# Altium project RFC_MB.PrjPcb (part 4 of 7)

## Sheet Hall.SchDoc
size 594 x 420 mm; Address1: Address1; Address2: Address2; Address3: Address3; Address4: Address4; SheetNumber: 1; Scale: 1:1; Разраб.: Иванов; Обозначение документа: АБВГ.123456.001 Э3; Пров.: Петров; Утв.: Сидоров; Наименование организации: ОАО "Концерн "МПО-Гидроприбор"; Перв. применение: АБВГ.123456.000; Наименование изделия 1: Плата; Наименование изделия 2: Схема электрическая; Наименование изделия 3: принципиальная; Нач. отд.: Нач. отд.; Фамилия нач. отд.: Сидоров
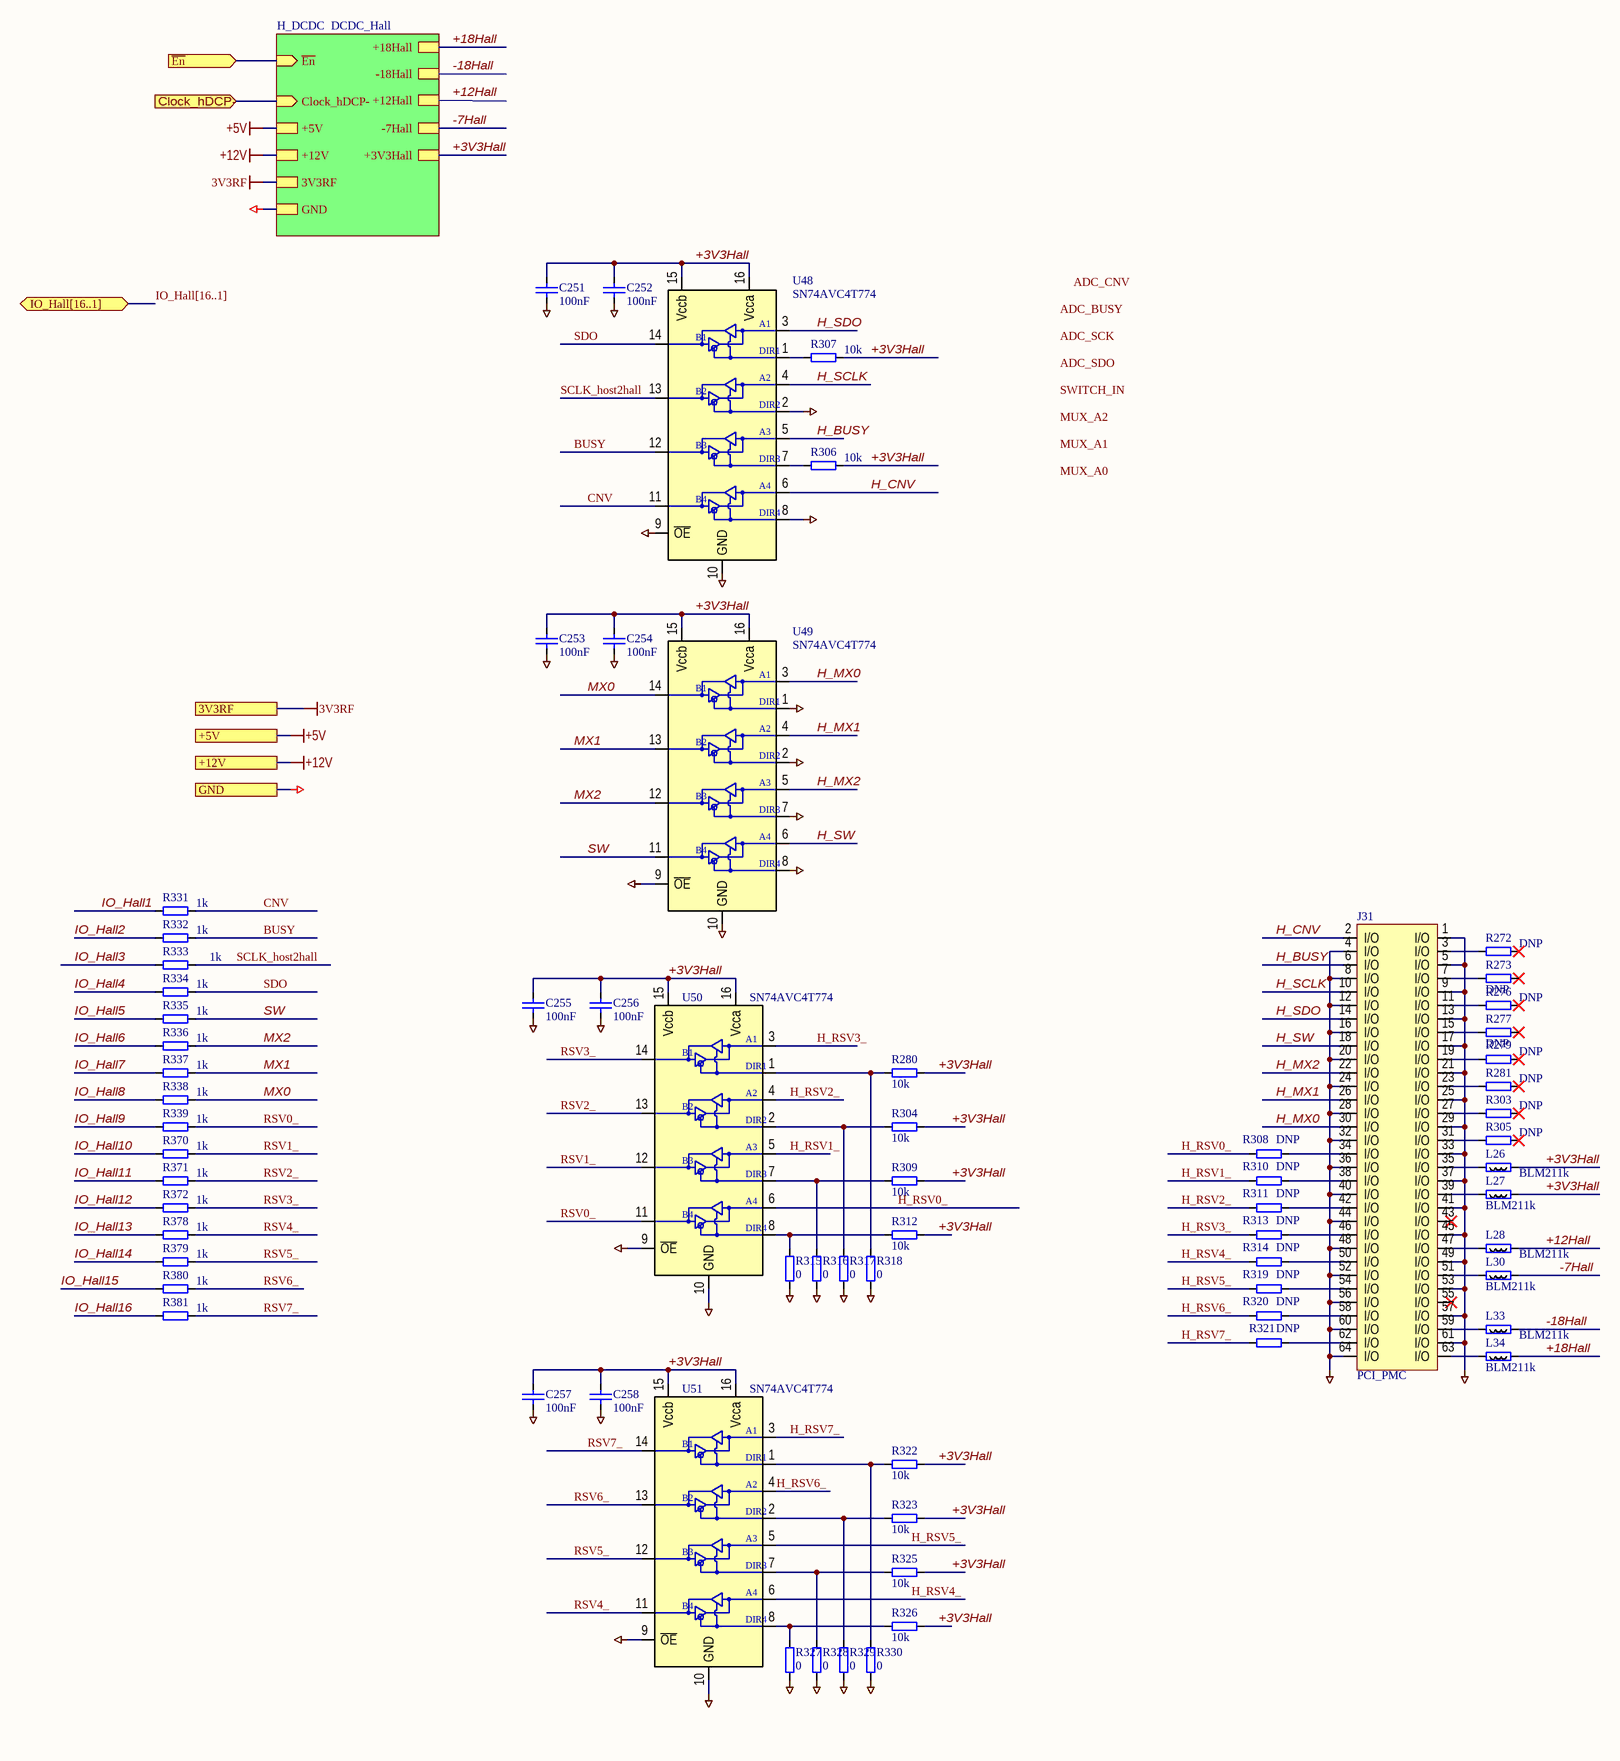
[diagram p13: Hall.SchDoc]

### Parts
C251  100nF  [SMD0805CAP]
C252  100nF  [SMD0805CAP]
C253  100nF  [SMD0805CAP]
C254  100nF  [SMD0805CAP]
C255  100nF  [SMD0805CAP]
C256  100nF  [SMD0805CAP]
C257  100nF  [SMD0805CAP]
C258  100nF  [SMD0805CAP]
J31  PCI_PMC  [TYCO_120521-1]
L26  BLM211k  [RESC2012X50N]
L27  BLM211k  [RESC2012X50N]
L28  BLM211k  [RESC2012X50N]
L30  BLM211k  [RESC2012X50N]
L33  BLM211k  [RESC2012X50N]
L34  BLM211k  [RESC2012X50N]
R272  DNP  [SMD0805RES]
R273  DNP  [SMD0805RES]
R276  DNP  [SMD0805RES]
R277  DNP  [SMD0805RES]
R279  DNP  [SMD0805RES]
R280  10k  [SMD0805RES]
R281  DNP  [SMD0805RES]
R303  DNP  [SMD0805RES]
R304  10k  [SMD0805RES]
R305  DNP  [SMD0805RES]
R306  10k  [SMD0805RES]
R307  10k  [SMD0805RES]
R308  DNP  [SMD0805RES]
R309  10k  [SMD0805RES]
R310  DNP  [SMD0805RES]
R311  DNP  [SMD0805RES]
R312  10k  [SMD0805RES]
R313  DNP  [SMD0805RES]
R314  DNP  [SMD0805RES]
R315  0  [SMD0805RES]
R316  0  [SMD0805RES]
R317  0  [SMD0805RES]
R318  0  [SMD0805RES]
R319  DNP  [SMD0805RES]
R320  DNP  [SMD0805RES]
R321  DNP  [SMD0805RES]
R322  10k  [SMD0805RES]
R323  10k  [SMD0805RES]
R325  10k  [SMD0805RES]
R326  10k  [SMD0805RES]
R327  0  [SMD0805RES]
R328  0  [SMD0805RES]
R329  0  [SMD0805RES]
R330  0  [SMD0805RES]
R331  1k  [SMD0805RES]
R332  1k  [SMD0805RES]
R333  1k  [SMD0805RES]
R334  1k  [SMD0805RES]
R335  1k  [SMD0805RES]
R336  1k  [SMD0805RES]
R337  1k  [SMD0805RES]
R338  1k  [SMD0805RES]
R339  1k  [SMD0805RES]
R370  1k  [SMD0805RES]
R371  1k  [SMD0805RES]
R372  1k  [SMD0805RES]
R378  1k  [SMD0805RES]
R379  1k  [SMD0805RES]
R380  1k  [SMD0805RES]
R381  1k  [SMD0805RES]
U48  SN74AVC4T774  [TSSOP-16]
U49  SN74AVC4T774  [TSSOP-16]
U50  SN74AVC4T774  [TSSOP-16]
U51  SN74AVC4T774  [TSSOP-16]

### Sub-sheets
H_DCDC = DCDC_Hall: +18Hall, -18Hall, +12Hall, -7Hall, +3V3Hall, ~{En} (in), Clock_hDCP- (in), GND, +12V, +5V, 3V3RF

### Ports
3V3RF, +5V, +12V, Clock_hDCP- (in), GND, IO_Hall[16..1] (bidir), ~{En} (in)

### Nets
3V3RF: port 3V3RF, sheet H_DCDC/3V3RF
+5V: port +5V, sheet H_DCDC/+5V
+12V: port +12V, sheet H_DCDC/+12V
GND: C251.1 C252.1 C253.1 C254.1 C255.1 C256.1 C257.1 C258.1 J31.1(I/O) J31.4(I/O) J31.5(I/O) J31.8(I/O) J31.9(I/O) J31.12(I/O) J31.13(I/O) J31.16(I/O) J31.17(I/O) J31.20(I/O) J31.21(I/O) J31.24(I/O) J31.25(I/O) J31.28(I/O) J31.29(I/O) J31.32(I/O) J31.33(I/O) J31.36(I/O) J31.37(I/O) J31.40(I/O) J31.41(I/O) J31.44(I/O) J31.45(I/O) J31.48(I/O) J31.49(I/O) J31.52(I/O) J31.53(I/O) J31.56(I/O) J31.57(I/O) J31.60(I/O) J31.61(I/O) J31.64(I/O) R315.1 R316.1 R317.1 R318.1 R327.1 R328.1 R329.1 R330.1 U48.2(DIR2) U48.8(DIR4) U48.9(~{OE}) U48.10(GND) U49.1(DIR1) U49.2(DIR2) U49.7(DIR3) U49.8(DIR4) U49.9(~{OE}) U49.10(GND) U50.9(~{OE}) U50.10(GND) U51.9(~{OE}) U51.10(GND) ; port GND, sheet H_DCDC/GND
+3V3Hall: C251.2 C252.2 C253.2 C254.2 C255.2 C256.2 C257.2 C258.2 L26.2 L27.2 R280.2 R304.2 R306.1 R307.1 R309.2 R312.2 R322.2 R323.2 R325.2 R326.2 U48.15(Vccb) U48.16(Vcca) U49.15(Vccb) U49.16(Vcca) U50.15(Vccb) U50.16(Vcca) U51.15(Vccb) U51.16(Vcca) ; sheet H_DCDC/+3V3Hall
+12Hall: L28.2 ; sheet H_DCDC/+12Hall
+18Hall: L34.2 ; sheet H_DCDC/+18Hall
-7Hall: L30.2 ; sheet H_DCDC/-7Hall
-18Hall: L33.2 ; sheet H_DCDC/-18Hall
~{En}: port ~{En}, sheet H_DCDC/~{En}
BUSY: R332.1 U48.12(B3)
Clock_hDCP-: port Clock_hDCP-, sheet H_DCDC/Clock_hDCP-
CNV: R331.1 U48.11(B4)
H_BUSY: J31.6(I/O) U48.5(A3)
H_CNV: J31.2(I/O) U48.6(A4)
H_MX0: J31.30(I/O) U49.3(A1)
H_MX1: J31.26(I/O) U49.4(A2)
H_MX2: J31.22(I/O) U49.5(A3)
H_RSV0_: R308.2 U50.6(A4)
H_RSV1_: R310.2 U50.5(A3)
H_RSV2_: R311.2 U50.4(A2)
H_RSV3_: R313.2 U50.3(A1)
H_RSV4_: R314.2 U51.6(A4)
H_RSV5_: R319.2 U51.5(A3)
H_RSV6_: R320.2 U51.4(A2)
H_RSV7_: R321.2 U51.3(A1)
H_SCLK: J31.10(I/O) U48.4(A2)
H_SDO: J31.14(I/O) U48.3(A1)
H_SW: J31.18(I/O) U49.6(A4)
IO_Hall1: R331.2  [project net IO_BL1]
IO_Hall2: R332.2  [project net IO_BL2]
IO_Hall3: R333.2  [project net IO_BL3]
IO_Hall4: R334.2  [project net IO_BL4]
IO_Hall5: R335.2  [project net IO_BL5]
IO_Hall6: R336.2  [project net IO_BL6]
IO_Hall7: R337.2  [project net IO_BL7]
IO_Hall8: R338.2  [project net IO_BL8]
IO_Hall9: R339.2  [project net IO_BL9]
IO_Hall10: R370.2  [project net IO_BL10]
IO_Hall11: R371.2  [project net IO_BL11]
IO_Hall12: R372.2  [project net IO_BL12]
IO_Hall13: R378.2  [project net IO_BL13]
IO_Hall14: R379.2  [project net IO_BL14]
IO_Hall15: R380.2  [project net IO_BL15]
IO_Hall16: R381.2  [project net IO_BL16]
MX0: R338.1 U49.14(B1)
MX1: R337.1 U49.13(B2)
MX2: R336.1 U49.12(B3)
RSV0_: R339.1 U50.11(B4)
RSV1_: R370.1 U50.12(B3)
RSV2_: R371.1 U50.13(B2)
RSV3_: R372.1 U50.14(B1)
RSV4_: R378.1 U51.11(B4)
RSV5_: R379.1 U51.12(B3)
RSV6_: R380.1 U51.13(B2)
RSV7_: R381.1 U51.14(B1)
SCLK_host2hall: R333.1 U48.13(B2)
SDO: R334.1 U48.14(B1)
SW: R335.1 U49.11(B4)
NetJ31_3: J31.3(I/O) R272.2
NetJ31_7: J31.7(I/O) R273.1
NetJ31_11: J31.11(I/O) R276.2
NetJ31_15: J31.15(I/O) R277.1
NetJ31_19: J31.19(I/O) R279.2
NetJ31_23: J31.23(I/O) R281.2
NetJ31_27: J31.27(I/O) R303.2
NetJ31_31: J31.31(I/O) R305.2
NetJ31_34: J31.34(I/O) R308.1
NetJ31_35: J31.35(I/O) L26.1
NetJ31_38: J31.38(I/O) R310.1
NetJ31_39: J31.39(I/O) L27.1
NetJ31_42: J31.42(I/O) R311.1
NetJ31_46: J31.46(I/O) R313.1
NetJ31_47: J31.47(I/O) L28.1
NetJ31_50: J31.50(I/O) R314.1
NetJ31_51: J31.51(I/O) L30.1
NetJ31_54: J31.54(I/O) R319.1
NetJ31_58: J31.58(I/O) R320.1
NetJ31_59: J31.59(I/O) L33.1
NetJ31_62: J31.62(I/O) R321.1
NetJ31_63: J31.63(I/O) L34.1
NetR280_1: R280.1 R318.2 U50.1(DIR1)
NetR304_1: R304.1 R317.2 U50.2(DIR2)
NetR306_2: R306.2 U48.7(DIR3)
NetR307_2: R307.2 U48.1(DIR1)
NetR309_1: R309.1 R316.2 U50.7(DIR3)
NetR312_1: R312.1 R315.2 U50.8(DIR4)
NetR322_1: R322.1 R330.2 U51.1(DIR1)
NetR323_1: R323.1 R329.2 U51.2(DIR2)
NetR325_1: R325.1 R328.2 U51.7(DIR3)
NetR326_1: R326.1 R327.2 U51.8(DIR4)

Not connected (* = marked no-connect by the designer): J31 43(I/O)* 55(I/O)*; R272 1*; R273 2*; R276 1*; R277 2*; R279 1*; R281 1*; R303 1*; R305 1*

### Buses and harness runs
bus IO_Hall[16..1] = port IO_Hall[16..1]

### Notes on the sheet
- Labels drawn without touching a wire or pin: ADC_BUSY, ADC_CNV, ADC_SCK, ADC_SDO, MUX_A0, MUX_A1, MUX_A2, SWITCH_IN
- Подп. и дата
- Инв. № дубл.
- Взам. инв. №
- Инв. № подл.
- Изм.
- Лист
- № докум.
- Подп.
- Дата
- Копировал
- Формат А2

### Library data of the parts
C251-C258 = C0805: as C151 on sheet RFCtl; Value: 100nF; Price: 2
J31 = PCI_PMC_M: PCI Mezzanine Connector; IEEE 1386 MainBoard; Manufactuer: TE Connectivity; PartField: 120527-1; SolderOption: 2; Pkg: PMC Male (IEEE 1386); Value: PCI_PMC; Vendor: TE Connectivity
L26-L28 L30 L33 L34 = BLM21: SMD Ferrite bead 0805; Vendor: Vishay; Value: 1k; Pkg: SMD0805; SMD Solders: 2; Solder Option: RM; Price: 10; Device: BLM21
R272 R276 R279 R281 R303 R305-R308 R310 R311 R313 R314 R319-R321 R331 R332 R334-R339 R370-R372 R378-R381 = R0805: Чип резистор 0805; Vendor: Vishay; SMD Solders: 2; Solder Option: i; TC: 100ppm/C; Tolerance: 1%; Pkg: SMD0805; Pwr: 125mW; Device: Res0805; Price: 2
  R272 R276 R279 R281 R303 R305 R308 R310 R311 R313 R314 R319-R321: Value: DNP
  R306 R307: Value: 10k
  R331 R332 R334-R339 R370-R372 R378-R381: Value: 1k
R273 R277 R280 R304 R309 R312 R315-R318 R322 R323 R325-R330 R333 = R0805: as R177 on sheet RFCtl; Price: 2
  R273 R277: Value: DNP
  R280 R304 R309 R312 R322 R323 R325 R326: Value: 10k
  R315-R318 R327-R330: Value: 0
  R333: Value: 1k
U48-U51 = SN74AVC4T774: Двунаправленный буфер; Pkg: TSSOP16; SMD Solders: 16; Solder Option: RM; THD Solders: 0; Vendor: Texas Instruments; Voltage: 1V1.. 3.6V  I/Os are 4.6-V Tolerant; Name to order: SN74AVC4T774PW; Device: SN74AVC4T774; Price: 300

## Sheet DCDC_Hall.SchDoc
size 420 x 297 mm; Address1: Address1; Address2: Address2; Address3: Address3; Address4: Address4; SheetNumber: 1; Scale: 1:1; Разраб.: Иванов; Обозначение документа: АБВГ.123456.001 Э3; Пров.: Петров; Утв.: Сидоров; Наименование организации: ОАО "Концерн "МПО-Гидроприбор"; Перв. применение: АБВГ.123456.000; Наименование изделия 1: Плата; Наименование изделия 2: Схема электрическая; Наименование изделия 3: принципиальная; Нач. отд.: Нач. отд.; Фамилия нач. отд.: Сидоров
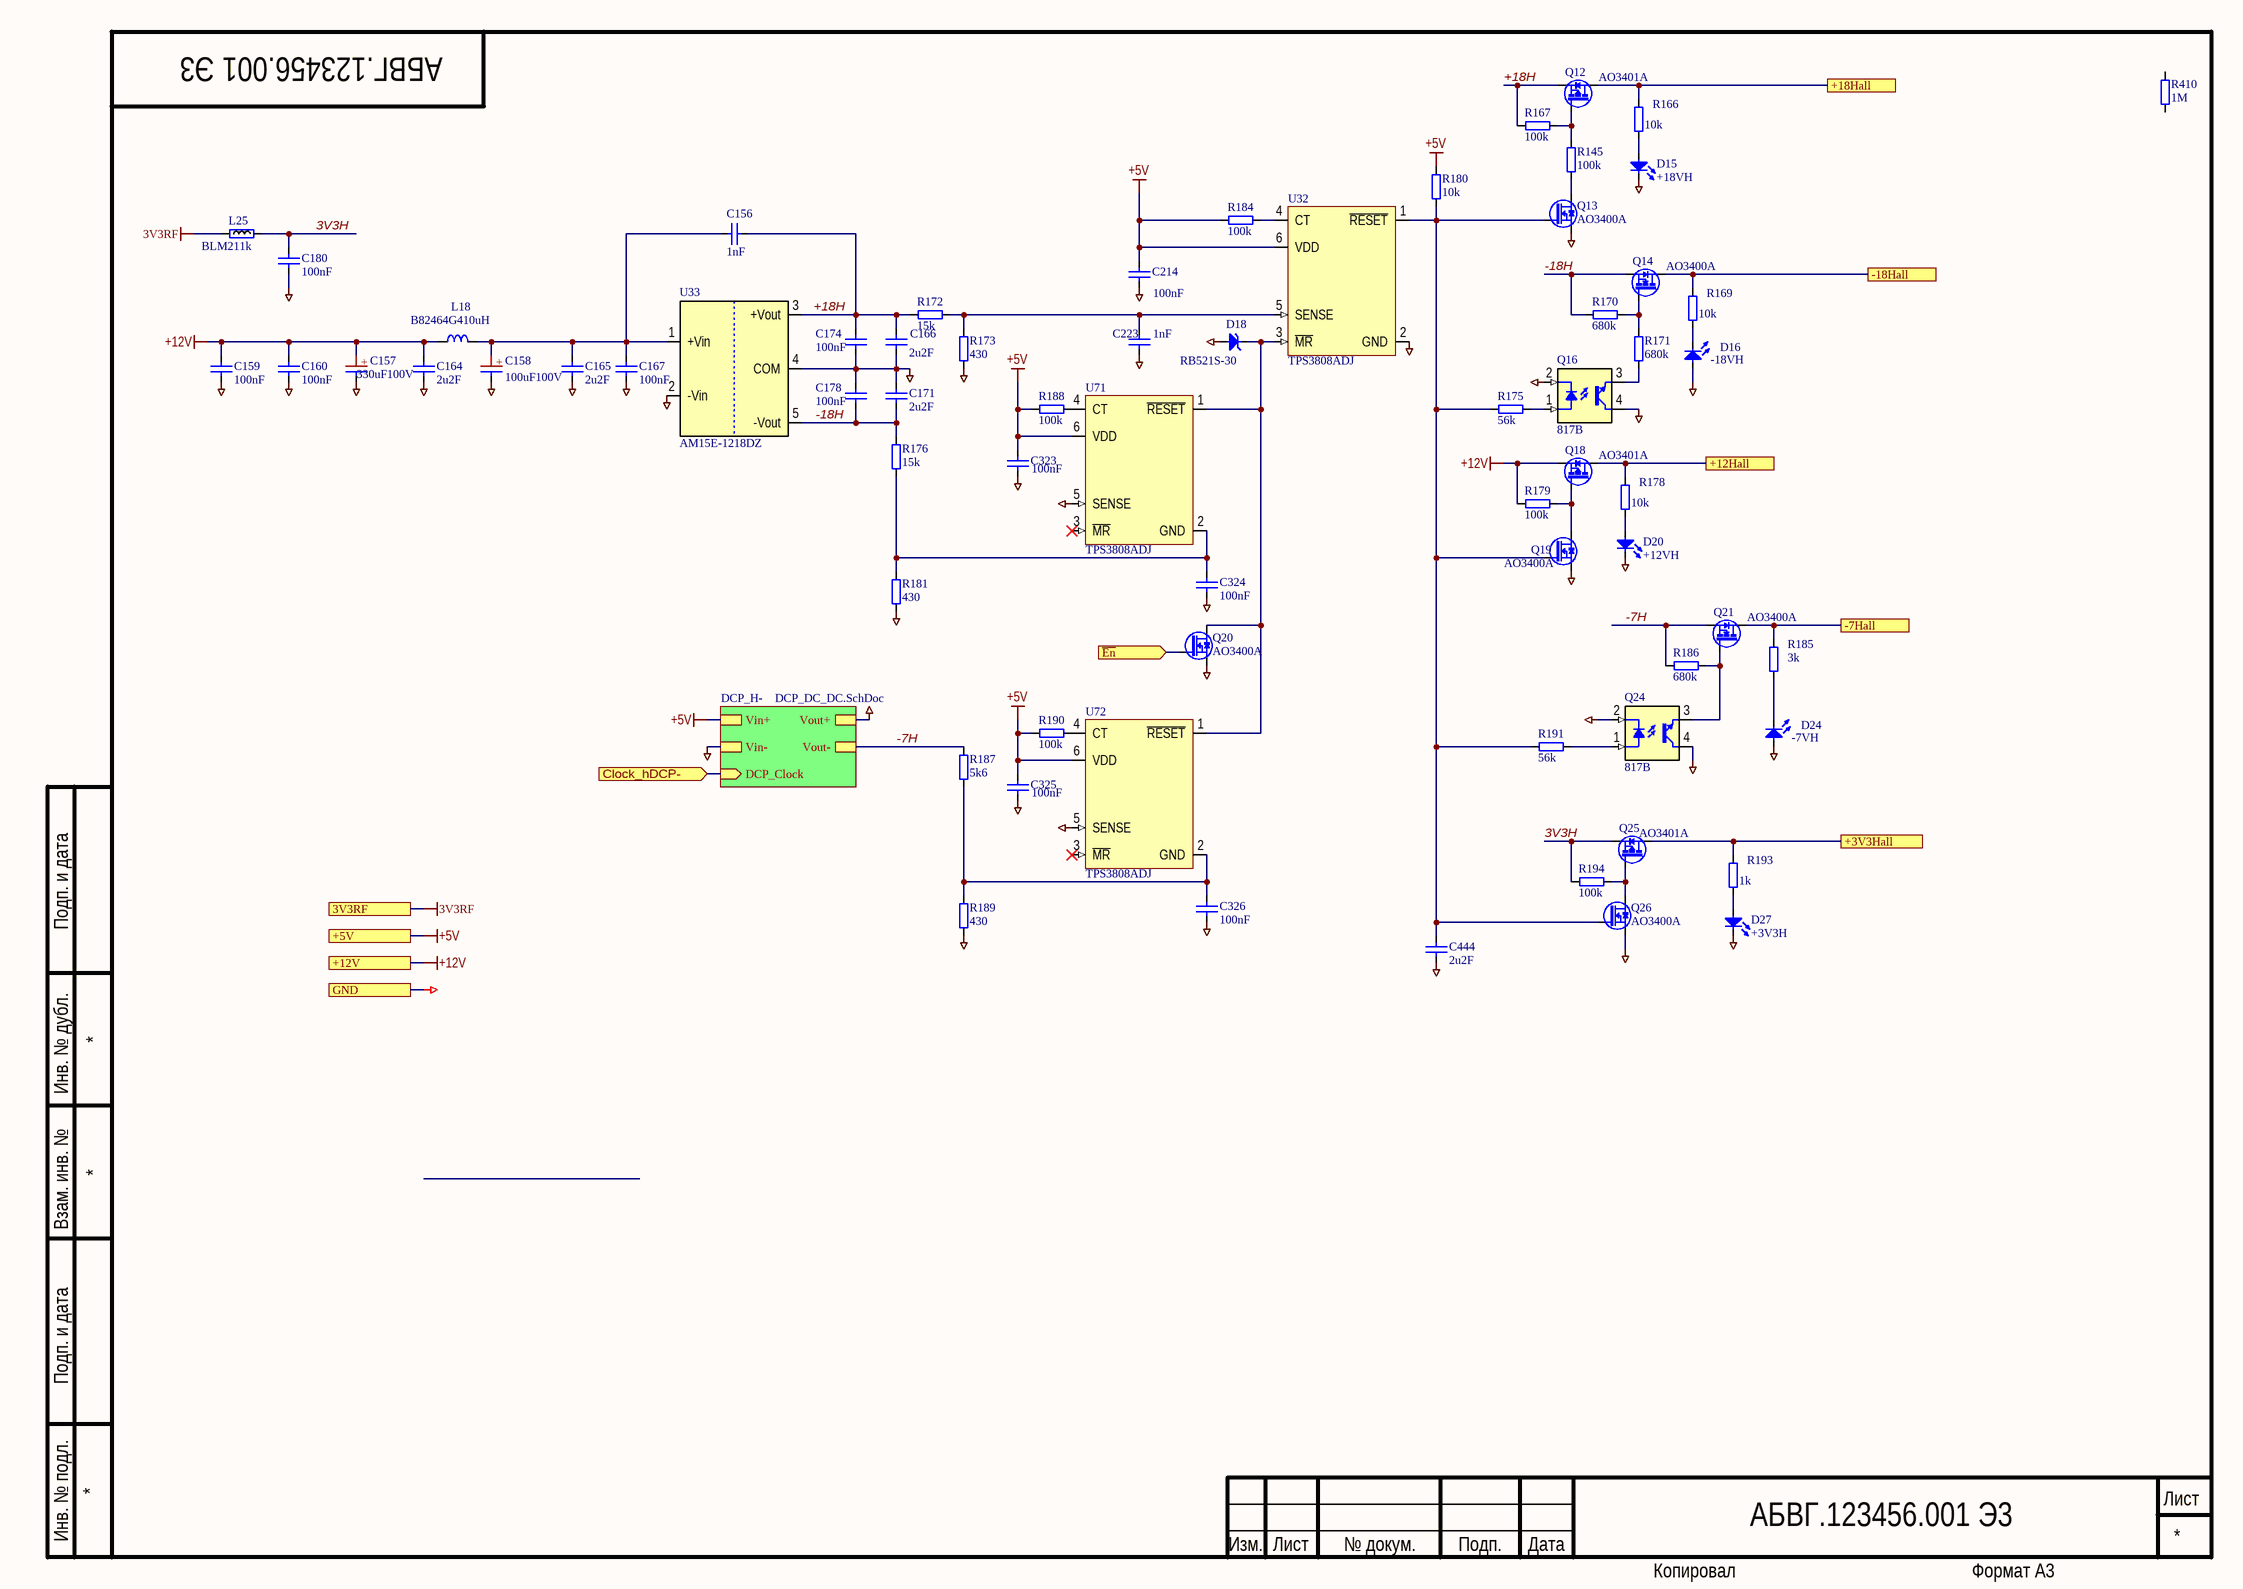
[diagram p14: DCDC_Hall.SchDoc]

### Parts
C156  1nF  [SMD0805CAP]
C157  330uF100V  [CAPPR750-1600X2000]
C158  100uF100V  [CAPPR500-1000X1250]
C159  100nF  [SMD0805CAP]
C160  100nF  [SMD0805CAP]
C164  2u2F  [SMD0805CAP]
C165  2u2F  [SMD0805CAP]
C166  2u2F  [SMD0805CAP]
C167  100nF  [SMD0805CAP]
C171  2u2F  [SMD0805CAP]
C174  100nF  [SMD0805CAP]
C178  100nF  [SMD0805CAP]
C180  100nF  [SMD0805CAP]
C214  100nF  [SMD0805CAP]
C223  1nF  [SMD0805CAP]
C323  100nF  [SMD0805CAP]
C324  100nF  [SMD0805CAP]
C325  100nF  [SMD0805CAP]
C326  100nF  [SMD0805CAP]
C444  2u2F  [SMD0805CAP]
D15  +18VH  [LED0603]
D16  -18VH  [LED0603]
D18  RB521S-30  [SODFL1608X65N]
D20  +12VH  [LED0603]
D24  -7VH  [LED0603]
D27  +3V3H  [LED0603]
L18  B82464G410uH  [IND_COILCRAFT_MSS1038]
L25  BLM211k  [RESC2012X50N]
Q12  AO3401A  [SOT95P229X119-3N]
Q13  AO3400A  [SOT95P229X119-3N]
Q14  AO3400A  [SOT95P229X119-3N]
Q16  817B  [DIP4-300]
Q18  AO3401A  [SOT95P229X119-3N]
Q19  AO3400A  [SOT95P229X119-3N]
Q20  AO3400A  [SOT95P229X119-3N]
Q21  AO3400A  [SOT95P229X119-3N]
Q24  817B  [DIP4-300]
Q25  AO3401A  [SOT95P229X119-3N]
Q26  AO3400A  [SOT95P229X119-3N]
R145  100k  [SMD0805RES]
R166  10k  [SMD0805RES]
R167  100k  [SMD0805RES]
R169  10k  [SMD0805RES]
R170  680k  [SMD0805RES]
R171  680k  [SMD0805RES]
R172  15k  [SMD0805RES]
R173  430  [SMD0805RES]
R175  56k  [SMD0805RES]
R176  15k  [SMD0805RES]
R178  10k  [SMD0805RES]
R179  100k  [SMD0805RES]
R180  10k  [SMD0805RES]
R181  430  [SMD0805RES]
R184  100k  [SMD0805RES]
R185  3k  [SMD0805RES]
R186  680k  [SMD0805RES]
R187  5k6  [SMD0805RES]
R188  100k  [SMD0805RES]
R189  430  [SMD0805RES]
R190  100k  [SMD0805RES]
R191  56k  [SMD0805RES]
R193  1k  [SMD0805RES]
R194  100k  [SMD0805RES]
R410  1M  [SMD0805RES]
U32  TPS3808ADJ  [SOT95P270X145-6N]
U33  AM15E-1218DZ  [AM15E]
U71  TPS3808ADJ  [SOT95P270X145-6N]
U72  TPS3808ADJ  [SOT95P270X145-6N]

### Sub-sheets
DCP_H- = DCP_DC_DC.SchDoc: DCP_Clock (in), Vout+, Vout-, Vin-, Vin+

### Ports
3V3RF, +3V3Hall, +5V, +12Hall, +12V, +18Hall, -7Hall, -18Hall, Clock_hDCP- (in), GND, ~{En} (in)

### Nets
3V3RF: L25.2 ; port 3V3RF
+5V: C214.2 C323.2 C325.2 R180.1 R184.1 R188.1 R190.1 U32.6(VDD) U71.6(VDD) U72.6(VDD) ; port +5V, sheet DCP_H-/Vin+
+12V: C157.1(+) C159.2 C160.2 C164.2 L18.1 Q18.2(S) R179.2 ; port +12V
GND: C157.2 C158.2 C159.1 C160.1 C164.1 C165.1 C166.1 C167.2 C171.2 C174.2 C178.1 C180.1 C214.1 C223.1 C323.1 C324.2 C325.1 C326.2 C444.2 D15.1(C) D16.2(A) D18.2(A) D20.1(C) D24.2(A) D27.1(C) Q13.2(S) Q16.2(C) Q16.4(C) Q19.2(S) Q20.2(S) Q24.2(C) Q24.4(C) Q26.2(S) R173.1 R181.1 R189.1 U32.2(GND) U33.2(-Vin) U33.4(COM) U71.5(SENSE) U72.5(SENSE) ; port GND, sheet DCP_H-/Vout+, sheet DCP_H-/Vin-
3V3H: C180.2 L25.1 Q25.2(S) R194.2
+3V3Hall: Q25.3(D) R193.2 ; port +3V3Hall
+12Hall: Q18.3(D) R178.2 ; port +12Hall
+18H: C156.2 C166.2 C174.1 Q12.2(S) R167.2 R172.2 U33.3(+Vout)
+18Hall: Q12.3(D) R166.2 ; port +18Hall
-7H: Q21.2(S) R186.2 R187.1 ; sheet DCP_H-/Vout-
-7Hall: Q21.3(D) R185.2 ; port -7Hall
-18H: C171.1 C178.2 Q14.2(S) R170.2 R176.1 U33.5(-Vout)
-18Hall: Q14.3(D) R169.2 ; port -18Hall
~{En}: Q20.1(G) ; port ~{En}
Clock_hDCP-: port Clock_hDCP-, sheet DCP_H-/DCP_Clock
NetC156_1: C156.1 C158.1(+) C165.2 C167.1 L18.2 U33.1(+Vin)
NetC223_2: C223.2 R172.1 R173.2 U32.5(SENSE)
NetC324_1: C324.1 R176.2 R181.2 U71.2(GND)
NetC326_1: C326.1 R187.2 R189.2 U72.2(GND)
NetC444_1: C444.1 Q13.1(G) Q19.1(G) Q26.1(G) R175.1 R180.2 R191.1 U32.1(~{RESET})
NetD15_2: D15.2(A) R166.1
NetD16_1: D16.1(C) R169.1
NetD18_1: D18.1(C) Q20.3(D) U32.3(~{MR}) U71.1(~{RESET}) U72.1(~{RESET})
NetD20_2: D20.2(A) R178.1
NetD24_1: D24.1(C) R185.1
NetD27_2: D27.2(A) R193.1
NetQ12_1: Q12.1(G) R145.2 R167.1
NetQ13_3: Q13.3(D) R145.1
NetQ14_1: Q14.1(G) R170.1 R171.2
NetQ16_1: Q16.1(A) R175.2
NetQ16_3: Q16.3(E) R171.1
NetQ18_1: Q18.1(G) Q19.3(D) R179.1
NetQ21_1: Q21.1(G) Q24.3(E) R186.1
NetQ24_1: Q24.1(A) R191.2
NetQ25_1: Q25.1(G) Q26.3(D) R194.1
NetR184_2: R184.2 U32.4(CT)
NetR188_2: R188.2 U71.4(CT)
NetR190_2: R190.2 U72.4(CT)

Not connected (* = marked no-connect by the designer): R410 1 2; U71 3(~{MR})*; U72 3(~{MR})*

### Notes on the sheet
- Подп. и дата
- Инв. № дубл.
- Взам. инв. №
- Инв. № подл.
- Изм.
- Лист
- № докум.
- Подп.
- Дата
- Копировал
- Формат А3

### Library data of the parts
C156 C159 C160 C164-C167 C171 C174 C178 C180 C214 C223 C323-C326 C444 = C0805: as C151 on sheet RFCtl; Price: 2
  C156 C223: Value: 1nF
  C159 C160 C167 C174 C178 C180 C214 C323-C326: Value: 100nF
  C164-C166 C171 C444: Value: 2u2F
C157 = CAP_POL_7_5x16: Конденсатор полярный d16 p7.5мм; Voltage: 100V; Vendor: Vishay; Value: 330uF; SMD Solders: 0; Solder Option: RM; Tolerance: 20%; Pkg: 7.5x16mm; Device: Cap+; THD Solders: 2; Price: 30
C158 = CAP_POL_5x10: Конденсатор полярный d10 p5мм; Voltage: 100V; Vendor: Vishay; Value: 100uF; SMD Solders: 0; Solder Option: RM; Tolerance: 20%; Pkg: 5x10mm; Device: Cap+; THD Solders: 2; Price: 20
D15 D16 D20 D24 D27 = LED0603: Чип светодиод 0603; Vendor: KB; SMD Solders: 2; Solder Option: RM; Pkg: SMD0603; Price: 10; Device: LED0603
  D15: Value: +18VH
  D16: Value: -18VH
  D20: Value: +12VH
  D24: Value: -7VH
  D27: Value: +3V3H
D18 = RB521S-30: Чип Шоттки диод; Vendor: CTK; Voltage: 30V; SMD Solders: 2; Solder Option: RM; Pkg: SOD523; Price: 5; Device: RB521S-30; Name to order: RB521S-30
L18 = B82464G4: SMD Дроссель; Vendor: Epcos; Value: 10uH; Voltage: 2; Solder Option: RM; Tolerance: 20%; Pkg: SMD10.4x10.4mm; THD Solders: 0; Name to order: B82464G4103M; Current: 3A5; Price: 400; SMD Solders: 2; Device: B82464G4
L25 = BLM21: as L26 on sheet Hall; Price: 10; Device: BLM21
Q12 Q18 Q25 = AO3401A: PMOS; Vendor: UMW; Pkg: SOT23; SMD Solders: 3; Solder Option: RM; THD Solders: 0; Voltage: -30V; Price: 10; Device: AO3401A; Name to order: AO3401A
Q13 Q14 Q19-Q21 Q26 = AO3400A: NMOS; Vendor: UMW; Pkg: SOT23; SMD Solders: 3; Solder Option: RM; Voltage: 30V; Price: 10; Device: AO3400A; Name to order: AO3400A
Q16 Q24 = 817B: Optotransistor; Pkg: DIP4; SMD Solders: 0; Solder Option: RM; THD Solders: 4; Vendor: UMW; Voltage: 35V; Device: 817B; Price: 10; Name to order: 817B; Current: 0
R145 R166 R167 R169-R173 R175 R176 R178-R181 R184-R191 R193 R194 R410 = R0805: as R177 on sheet RFCtl; Price: 2
  R145 R167 R179 R184 R188 R190 R194: Value: 100k
  R166 R169 R178 R180: Value: 10k
  R170 R171 R186: Value: 680k
  R172 R176: Value: 15k
  R173 R181 R189: Value: 430
  R175 R191: Value: 56k
  R185: Value: 3k
  R187: Value: 5k6
  R193: Value: 1k
  R410: Value: 1M
U32 U71 U72 = TPS3808: as U79 on sheet RFCtl; Price: 200; Device: TPS3808
U33 = AM15E-: Negative LDO Linear stabilizer; Vendor: Aimtec; Value: 1218DZ; Pkg: DCDC_5; SMD Solders: 0; Solder Option: RM; THD Solders: 5; Name to order: AM15-1218DZ; Price: 2000; Device: AM15E-